# EAGLE design i2c_air_temp_humi_ds18b20_hw2.0 (EAGLE 6.4)
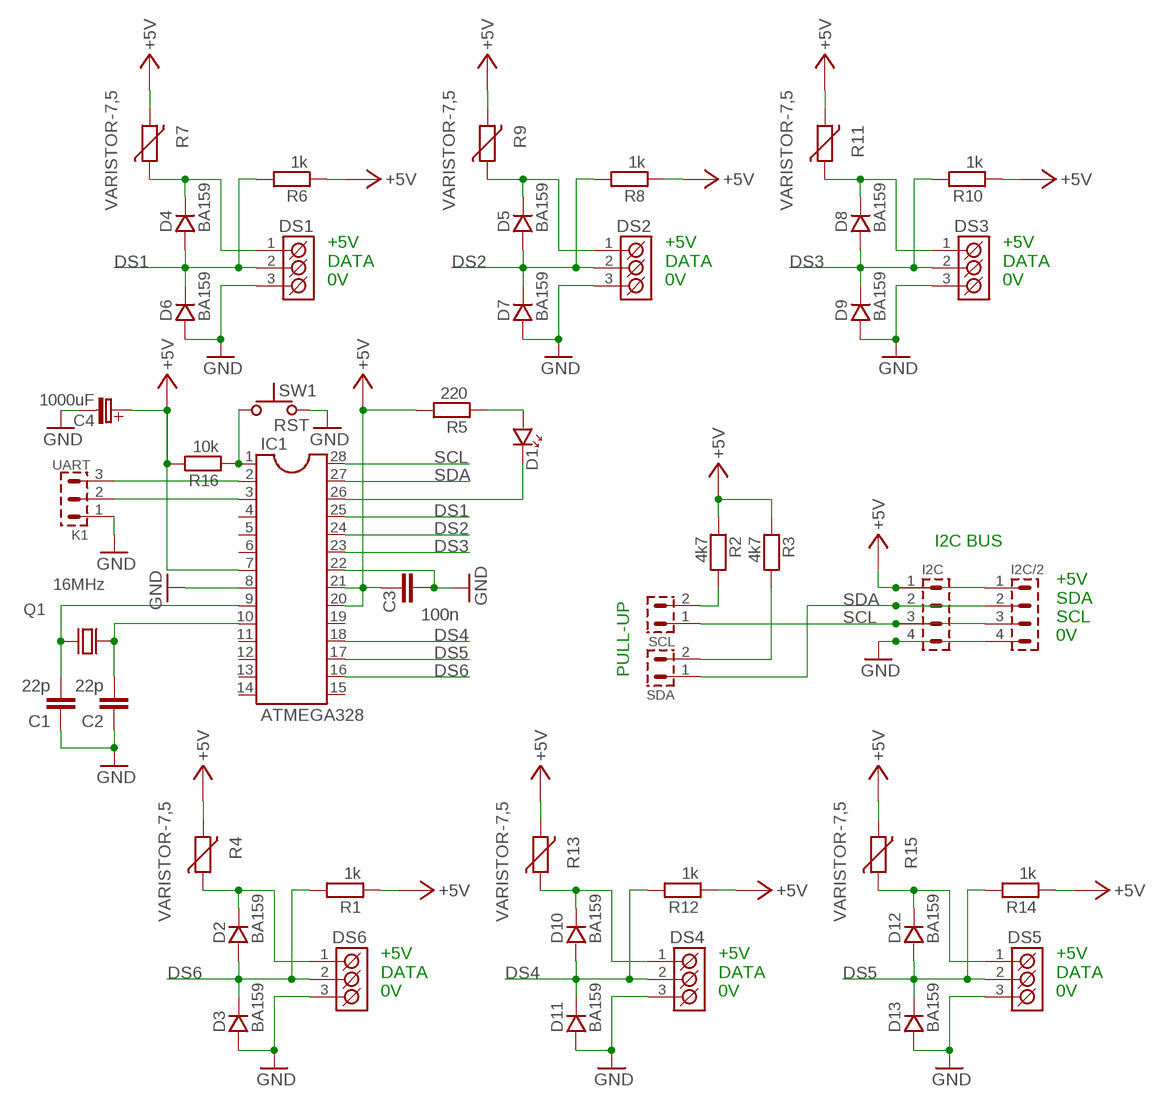
[diagram p0: schematic, sheet 1]

## Parts
C1  22p  C5/3  [C5B3]
C2  22p  C5/3  [C5B3]
C3  100n  C5/3  [C5B3]
C4  1000uF  C-EL_5  [C-EL_5]
D1  LED_3  [LED_3]
D2  BA159  [DO41]
D3  BA159  [DO41]
D4  BA159  [DO41]
D5  BA159  [DO41]
D6  BA159  [DO41]
D7  BA159  [DO41]
D8  BA159  [DO41]
D9  BA159  [DO41]
D10  BA159  [DO41]
D11  BA159  [DO41]
D12  BA159  [DO41]
D13  BA159  [DO41]
DS1  ARK500/3  [ARK500/3]
DS2  ARK500/3  [ARK500/3]
DS3  ARK500/3  [ARK500/3]
DS4  ARK500/3  [ARK500/3]
DS5  ARK500/3  [ARK500/3]
DS6  ARK500/3  [ARK500/3]
I2C  PSH02-04P  [PSH02-04P]
I2C/2  PSH02-04P  [PSH02-04P]
IC1  ATMEGA328  DIL28-3  [DIL28-3]
K1  UART  PSH02-03P  [PSH02-03P]
Q1  16MHz  Q_HC-49U  [HC-49U]
R1  1k  R_7,5  [R-7,5]
R2  4k7  R_7,5  [R-7,5]
R3  4k7  R_7,5  [R-7,5]
R4  VARISTOR-7,5  [R-7,5]
R5  220  R_7,5  [R-7,5]
R6  1k  R_7,5  [R-7,5]
R7  VARISTOR-7,5  [R-7,5]
R8  1k  R_7,5  [R-7,5]
R9  VARISTOR-7,5  [R-7,5]
R10  1k  R_7,5  [R-7,5]
R11  VARISTOR-7,5  [R-7,5]
R12  1k  R_7,5  [R-7,5]
R13  VARISTOR-7,5  [R-7,5]
R14  1k  R_7,5  [R-7,5]
R15  VARISTOR-7,5  [R-7,5]
R16  10k  R_7,5  [R-7,5]
SCL  S1G2_JUMP  [S1G2_JUM]
SDA  S1G2_JUMP  [S1G2_JUM]
SW1  RST  P-B1720  [P-B1720]

## Nets
+5V: C3.1 C4.C+(C_EL+) I2C.1 I2C/2.1 IC1.7 IC1.20 IC1.21 R1.1 R2.1 R3.1 R4.2 R5.2 R6.1 R7.2 R8.1 R9.2 R10.1 R11.2 R12.1 R13.2 R14.1 R15.2 R16.2
DS1: D4.A D6.K DS1.2(K2) IC1.25 R6.2
DS2: D5.A D7.K DS2.2(K2) IC1.24 R8.2
DS3: D8.A D9.K DS3.2(K2) IC1.23 R10.2
DS4: D10.A D11.K DS4.2(K2) IC1.18 R12.2
DS5: D12.A D13.K DS5.2(K2) IC1.17 R14.2
DS6: D2.A D3.K DS6.2(K2) IC1.16 R1.2
GND: C1.1 C2.1 C3.2 C4.C-(C_EL-) D3.A D6.A D7.A D9.A D11.A D13.A DS1.3(K3) DS2.3(K3) DS3.3(K3) DS4.3(K3) DS5.3(K3) DS6.3(K3) I2C.4 I2C/2.4 IC1.8 IC1.22 K1.1 SW1.2
N$1: D2.K DS6.1(K1) R4.1
N$2: C2.2 IC1.10 Q1.1
N$3: D1.K IC1.26
N$4: D1.A R5.1
N$5: R2.2 SCL.2
N$6: R3.2 SDA.2
N$7: D4.K DS1.1(K1) R7.1
N$8: D5.K DS2.1(K1) R9.1
N$9: D10.K DS4.1(K1) R13.1
N$10: D12.K DS5.1(K1) R15.1
N$12: D8.K DS3.1(K1) R11.1
N$13: IC1.1 R16.1 SW1.1
N$14: IC1.2 K1.3
N$15: IC1.3 K1.2
N$21: C1.2 IC1.9 Q1.2
SCL: I2C.3 I2C/2.3 IC1.28 SCL.1
SDA: I2C.2 I2C/2.2 IC1.27 SDA.1
Unconnected: IC1.4 IC1.5 IC1.6 IC1.11 IC1.12 IC1.13 IC1.14 IC1.15 IC1.19 SW1.3(1A) SW1.4(2A)

## Notes on the sheet
- +5V
  DATA
  0V
- +5V
  DATA
  0V
- +5V
  DATA
  0V
- I2C BUS
- +5V
  SDA
  SCL
  0V
- PULL-UP
- +5V
  DATA
  0V
- +5V
  DATA
  0V
- +5V
  DATA
  0V

## Library data of the parts
C1-C3 = capacitor-wima:C: CAPACITOR naming: grid - package width
C4 = #PaJa_31:C-EL: Kondenzator - elektrolyticky
D1 = #PaJa_31:LED: LED - jednobarevna
D2-D13 = #PaJa_31:BA159: Rychlá dioda - 1A, 1000V
DS1-DS6 = #PaJa_konektory:ARK500/3: Svorkovnice - roztec 5mm - trojita
I2C I2C/2 = #PaJa_konektory:PSH02-04: Konektory se zamkem - vidlice - 4pin
IC1 = ic-package:DIL28: Dual In Line
K1 = #PaJa_konektory:PSH02-03: Konektory se zamkem - vidlice - 3pin
Q1 = #PaJa_31:Q: Krystal HC-49 - 1MHz - 48MHz DT38 - Quartz (hodinovy) 32,768kHz
R1-R3 R5 R6 R8 R10 R12 R14 R16 = #PaJa_31:R: Rezistor
R4 R7 R9 R11 R13 R15 = varistor:VARISTOR: VARISTOR
SCL SDA = #PaJa_konektory:S1G2_JUMP: Radove konektory - koliky - 2x
SW1 = #PaJa_prepinace:P-B1720: µ-tlacitko

## Board
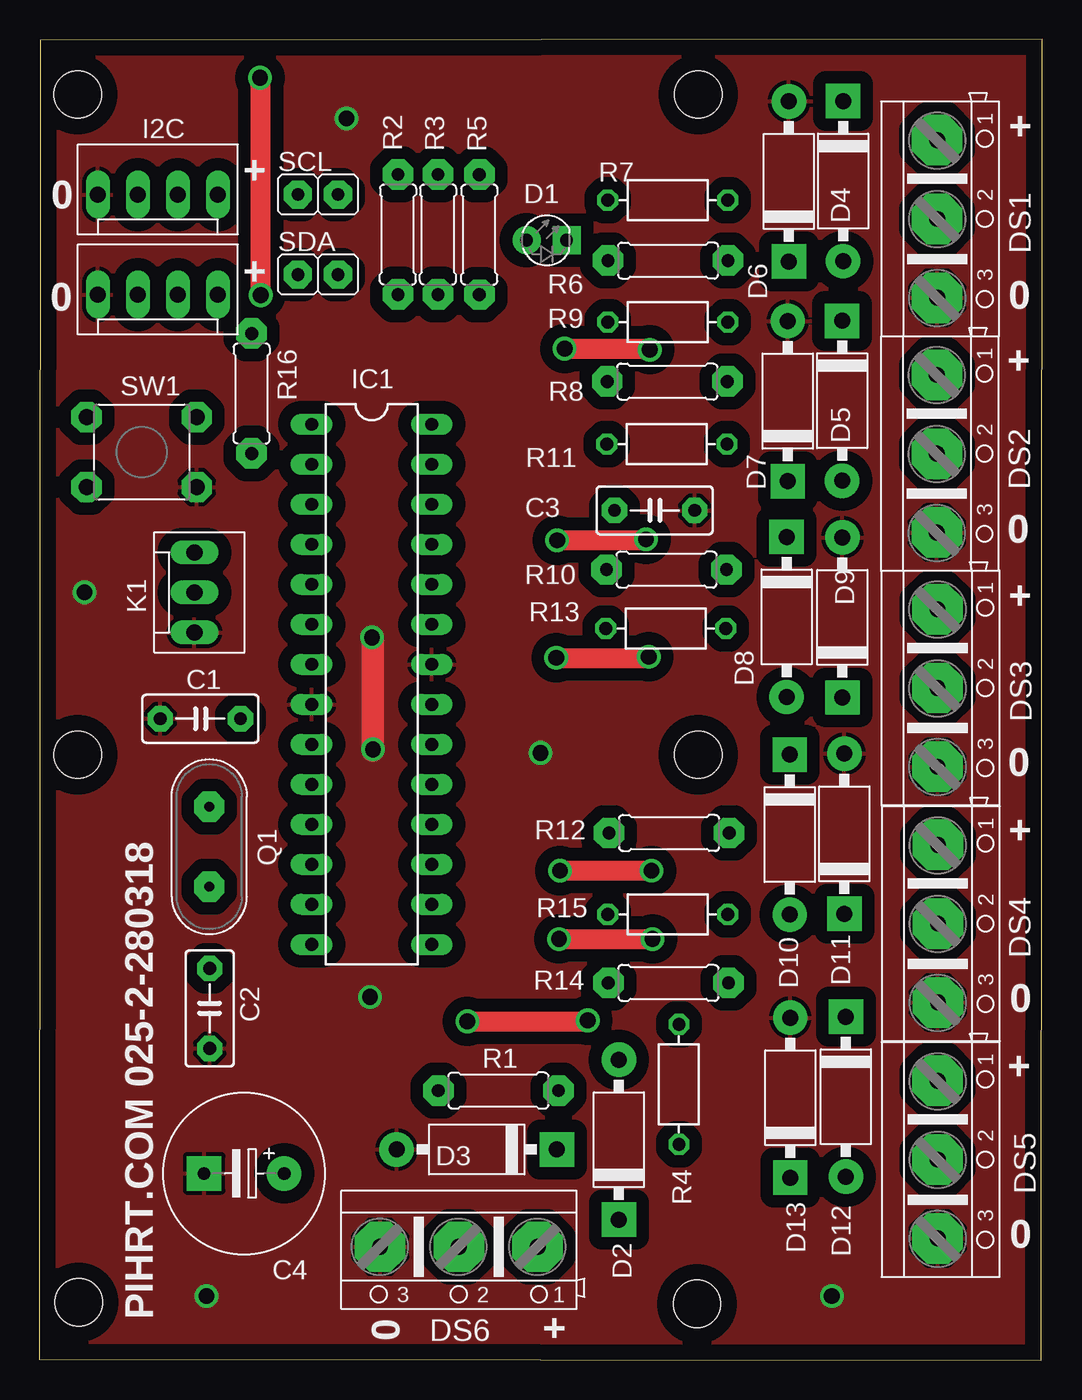
[diagram p1: board, top side]
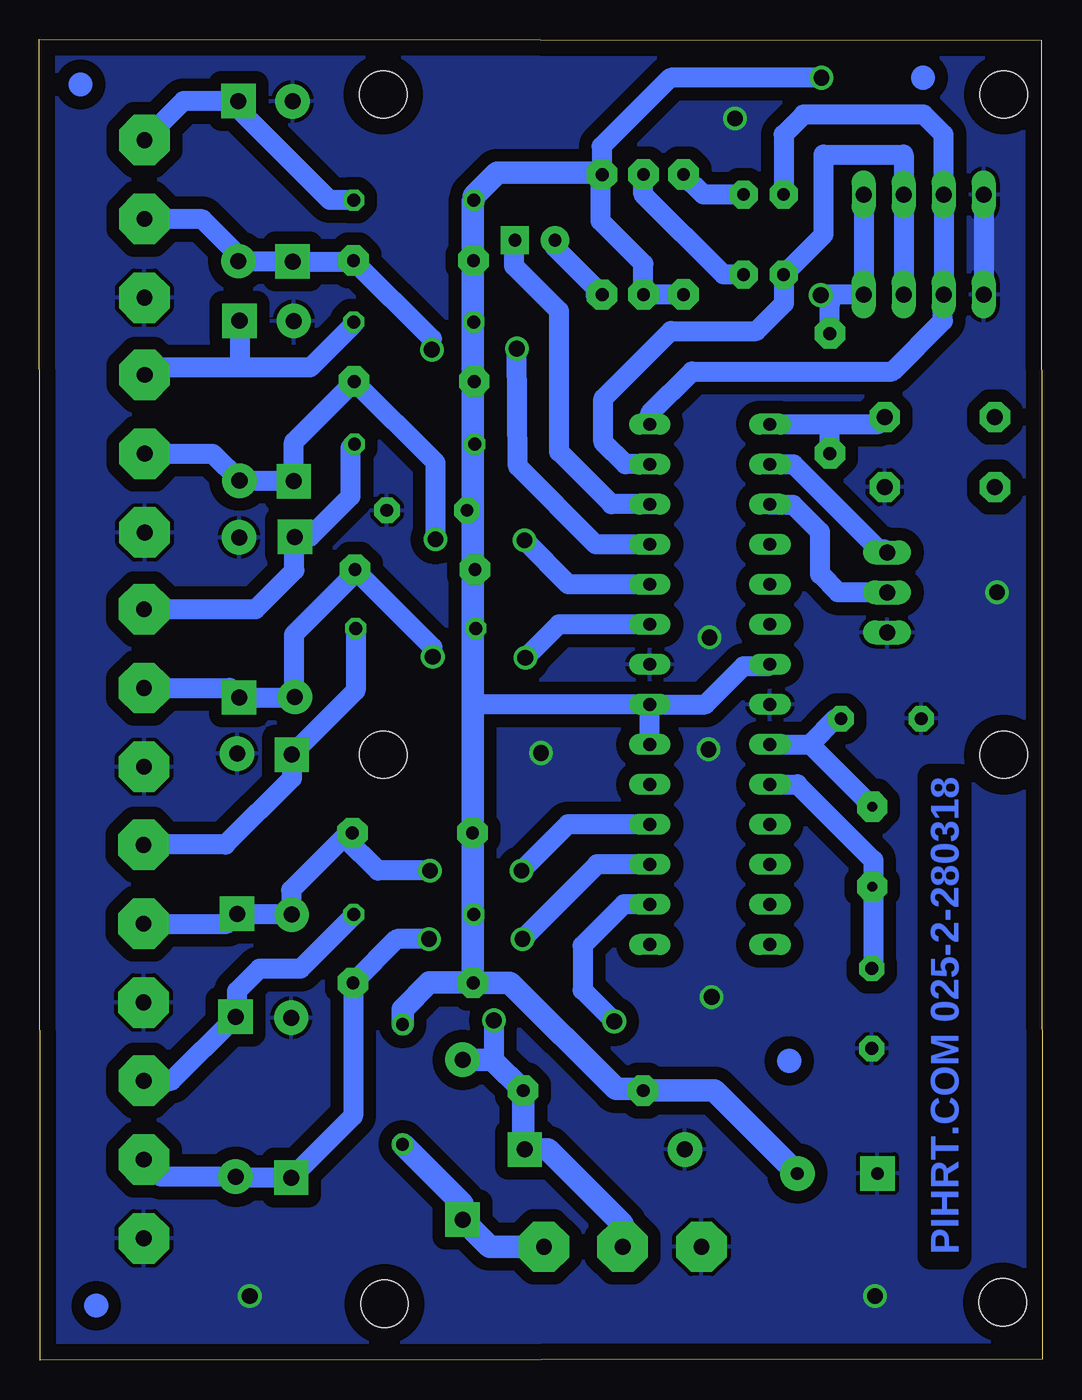
[diagram p2: board, bottom side, seen from below]

Size 63.63 x 83.84 mm. Coordinates in mm from the lower left corner, seen from the top.
Outline: 0,0.05 63.58,0 63.63,83.84 0.05,83.79 0,0.05
Copper layers (1*16): Top 0.035mm / dielectric 1.5mm / Bottom 0.035mm
Design rules "default": minimum track width 10mil, minimum drill 24mil, track to track 8mil, track to pad 8mil, pad to pad 8mil, via to via 8mil, smd to smd 8mil, copper to edge 40mil, drill to drill 8mil, minimum pad ring 10mil, minimum via ring 8mil, stop-mask expansion 4mil, vias tented up to drill 0mil, thermal gap 10mil
Holes 3 mm at 2.44,38.43 41.81,38.43 41.81,80.34 2.44,80.34 41.73,3.57 2.49,3.67

### Footprints (pad centres in the part's own frame; a part is rotated, then mirrored left to right if it is on the bottom)
C5B3 = drill 0.813 pad 1.6 octagon: 1 -2.54,0; 2 2.54,0
C-EL_5 = drill 0.813 pad 2.184: C+ -2.54,0 | drill 0.813 pad 2.184 square: C- 2.54,0
LED_3 = drill 0.813 pad 1.778: A -1.27,0 | drill 0.813 pad 1.778 square: K 1.27,0
DO41 = drill 1.016 pad 2.184: A -5.08,0 | drill 1.016 pad 2.184 square: K 5.08,0
ARK500/3 = drill 1 pad 3.2 octagon: 1 -5,0; 2 0,0; 3 5,0
PSH02-04P = drill 1.016 pad 1.422 long: 1 -3.81,0; 2 -1.27,0; 3 1.27,0; 4 3.81,0
DIL28-3 = drill 0.813 long: 1 -16.51,-3.81; 2 -13.97,-3.81; 3 -11.43,-3.81; 4 -8.89,-3.81; 5 -6.35,-3.81; 6 -3.81,-3.81; 7 -1.27,-3.81; 8 1.27,-3.81; 9 3.81,-3.81; 10 6.35,-3.81; 11 8.89,-3.81; 12 11.43,-3.81; 13 13.97,-3.81; 14 16.51,-3.81; 15 16.51,3.81; 16 13.97,3.81; 17 11.43,3.81; 18 8.89,3.81; 19 6.35,3.81; 20 3.81,3.81; 21 1.27,3.81; 22 -1.27,3.81; 23 -3.81,3.81; 24 -6.35,3.81; 25 -8.89,3.81; 26 -11.43,3.81; 27 -13.97,3.81; 28 -16.51,3.81
PSH02-03P = drill 1.016 pad 1.422 long: 1 -2.54,0; 2 0,0; 3 2.54,0
HC-49U = drill 0.61 pad 1.93 octagon: 1 -2.54,0; 2 2.54,0
R-7,5 = drill 0.813 pad 1.93 octagon: 1 -3.81,0; 2 3.81,0
R-7,5' = drill 0.813 octagon: 1 -3.81,0; 2 3.81,0
S1G2_JUM = drill 0.813 pad 1.778 octagon: 1 -1.27,0; 2 1.27,0
P-B1720 = drill 1 pad 1.93 octagon: 1 -3.493,-2.223; 2 -3.493,2.223; 3 3.493,-2.223; 4 3.493,2.223

### Placement (x,y rotation side)
C1  10.22,40.72 0 top
C2  10.8,22.32 90 top
C3  39.04,53.94 0 top
C4  12.99,11.84 180 top
D1  32.18,71.09 0 top
D2  36.77,13.99 270 top
D3  27.75,13.37 0 top
D4  51,74.84 90 top
D5  50.93,60.9 90 top
D6  47.56,74.82 270 top
D7  47.49,60.88 270 top
D8  47.42,47.18 90 top
D9  50.96,47.14 270 top
D10  47.62,33.36 90 top
D11  51.09,33.41 270 top
D12  51.18,16.72 90 top
D13  47.65,16.66 270 top
DS1  56.97,72.44 270 top
DS2  56.95,57.54 270 top
DS3  56.99,42.67 270 top
DS4  57.02,27.71 270 top
DS5  57,12.73 270 top
DS6  26.62,7.2 180 top
I2C  7.52,67.64 180 top
I2C/2  7.52,73.99 180 top
IC1  21.09,42.9 270 top
K1  9.84,48.74 90 top
Q1  10.78,32.6 90 top
R1  29.13,17.11 0 top
R2  22.76,71.45 90 top
R3  25.3,71.45 90 top
R4  VARISTOR-7,5  [R-7,5']  40.58,17.51 90 top
R5  27.92,71.44 90 top
R6  39.89,69.8 0 top
R7  VARISTOR-7,5  [R-7,5']  39.87,73.63 180 top
R8  39.84,62.12 0 top
R9  VARISTOR-7,5  [R-7,5']  39.88,65.9 180 top
R10  39.8,50.19 0 top
R11  VARISTOR-7,5  [R-7,5']  39.82,58.15 180 top
R12  39.96,33.47 0 top
R13  VARISTOR-7,5  [R-7,5']  39.75,46.45 180 top
R14  39.91,23.95 0 top
R15  VARISTOR-7,5  [R-7,5']  39.88,28.29 180 top
R16  13.47,61.36 90 top
SCL  17.68,73.99 0 top
SDA  17.68,68.91 0 top
SW1  6.49,57.64 180 top

### Tracks (layer width: path | path; a pad name or v marks a point on that pad's centre or on a via)
+5V  (via drill 1)
  Top 1.27: v14.05,67.61 14.05,81.36 v14,81.41
  Bottom 0.813: R6.1 36.08,68.83 36.14,68.78 36.14,65.97 R9.2 36.07,62.15 R8.1 36.01,62.1 R11.2 | C3.1 36.5,54.1 36.14,54.46 | R10.1 35.99,52.23 36.14,52.38 | 35.99,46.49 35.99,49.48 36.14,49.63 | R15.2 36.07,32.29 36.14,32.36 | R12.1 36.15,32.51 36.14,32.5
  Bottom 1.27: I2C/2.1 I2C.1 14.01,67.64 v14.05,67.61 | 36.08,73.61 R7.2 | 35.99,46.49 R13.2 | IC1.20 IC1.21 | IC1.21 21.37,41.63 18.95,44.05 17.4,44.05 IC1.7 | 25.16,67.43 24.95,67.64 R2.1 R3.1 25.3,69.6 28.01,72.31 28.01,75.16 R5.2 27.95,75.28 27.95,77.05 23.59,81.41 v14,81.41 | 14,67.56 v14.05,67.61 | IC1.21 35.95,41.63 36.14,41.81 | R16.2 13.47,67.03 v14.05,67.61
  Bottom 1.422: R4.2 40.58,22.28 38.88,23.98 36.14,23.98 | 36.14,23.98 R14.1 33.77,23.95 27.04,17.21 25.42,17.21 R1.1 20.8,17.11 C4.C+ | 36.14,23.98 36.14,32.36 36.14,32.5 36.14,41.81 36.14,49.63 36.14,52.38 36.14,54.46 36.14,68.78 36.14,73.56 R7.2 36.06,73.89 34.58,75.37 28.03,75.37 R5.2
DS1  (via drill 1)
  Top 1.27: v33.33,64.21 38.74,64.21 v38.73,64.14
  Bottom 1.27: DS1.2 56.95,72.42 53.29,72.42 51,70.14 D4.A 47.58,69.76 D6.K 43.76,69.74 R6.2 38.73,64.83 v38.73,64.14 | IC1.25 28.31,51.79 33.27,56.74 v33.33,64.21
DS2  (via drill 1)
  Top 1.27: v32.85,52.04 38.44,52.04 v38.49,52.1
  Bottom 1.27: DS2.2 52.65,57.54 D5.A 47.51,55.82 D7.K 47.49,58.29 R8.2 38.49,56.96 v38.49,52.1 | IC1.24 30.06,49.25 v32.85,52.04
DS3  (via drill 1)
  Top 1.27: v32.8,44.58 38.61,44.58 v38.67,44.64
  Bottom 1.27: DS3.2 51.56,42.67 D9.K 47.45,42.06 D8.A 47.48,42.16 47.48,46.05 43.61,49.93 R10.2 38.67,45.25 v38.67,44.64 | IC1.23 30.67,46.71 v32.8,44.58
DS4  (via drill 1)
  Top 1.27: v33.03,31.08 v38.85,31.08
  Bottom 1.27: DS4.2 51.72,27.71 D11.K 47.67,28.33 D10.A 47.66,28.32 47.66,29.84 44.28,33.22 | R12.2 44.04,33.47 44.28,33.22 | IC1.18 30.1,34.01 v33.03,31.08 | v38.85,31.08 42.14,31.08 44.28,33.22
DS5  (via drill 1)
  Top 1.27: v32.97,26.73 v38.91,26.73 38.96,26.73
  Bottom 1.27: DS5.2 55.91,11.64 D12.A 51.11,11.58 D13.K 43.72,15.5 R14.2 40.94,26.73 v38.91,26.73 | IC1.17 28.23,31.47 v32.97,26.73
DS6  (via drill 1)
  Top 1.27: v27.16,21.5 34.73,21.5 v34.79,21.56
  Bottom 1.27: IC1.16 26.55,28.93 29.15,26.32 29.15,23.5 v27.16,21.5 | v34.79,21.56 34.79,19.25 34.97,19.07
  Bottom 1.422: D2.A 34.97,19.07 34.89,19.07 R1.2 32.94,13.48 D3.K 31.37,13.37 26.63,8.63 26.63,7.21 DS6.2
GND  (via drill 1)
  Top 1.422: 21.16,38.71 21.16,45.76 21.11,45.82
  Bottom 1.27: I2C/2.4 I2C.4 3.69,67.64
  other vias: 21.16,38.77 21.11,45.88 19.49,78.83 2.86,48.73 20.97,23.05 10.6,4.07 50.29,4.07 31.8,38.54
  pour Bottom (isolate 0.813): -1.52,85.14 66.33,85.14 66.33,-3.39 -1.52,-3.39 -1.48,84.39
  pour Top (isolate 0.813): -0.67,83.86 65.05,83.86 65.05,-1.68 -0.53,-1.68 -0.61,83.45
N$1
  Bottom 1.422: DS6.1 35.06,7.2 D2.K 36.77,9.89 R4.1
N$2
  Bottom 1.27: IC1.10 15.53,36.55 10.71,31.72 10.71,30.61 | 10.71,30.61 10.71,24.96 C2.2 | Q1.1 10.78,30.54 10.71,30.61
N$3
  Bottom 1.27: IC1.26 27.32,54.33 30.66,57.66 30.66,66.59 33.51,69.45 33.51,71.03 D1.K
N$4
  Bottom 1.27: 28.34,67.63 R5.1 30.91,70.63 D1.A
N$5
  Bottom 1.27: SCL.2 21.49,73.99 R2.2
N$6
  Bottom 1.27: SDA.2 20.22,68.91 25.3,73.99 R3.2
N$7
  Bottom 1.27: D4.K 51.49,79.92 | 51.49,79.92 54.49,79.92 DS1.1 | R7.1 45.21,73.63 51.49,79.92
N$8
  Bottom 1.27: R9.1 43.69,65.77 46.46,63 51.15,63 | 51.15,63 56.48,63 DS2.1 | D5.K 50.93,63.22 51.15,63
N$9
  Bottom 1.27: R13.1 43.56,42.49 D10.K 47.62,36.93 51.83,32.72 57,32.72 DS4.1
N$10
  Bottom 1.27: DS5.1 55.25,17.73 D12.K 51.1,21.87 51.1,23.42 49.68,24.84 47.06,24.84 43.69,28.22 R15.1
N$12
  Bottom 1.27: DS3.1 49.91,47.67 47.45,50.13 47.45,52.22 D8.K 46.47,52.26 43.88,54.85 43.88,57.9 R11.1
N$13
  Bottom 1.27: IC1.1 13.06,59.41 | 13.06,59.41 10.44,59.41 SW1.1 | R16.1 13.47,58.99 13.06,59.41
N$14
  Bottom 1.27: IC1.2 15.79,56.87 10.4,51.48 10.04,51.48 K1.3
N$15
  Bottom 1.27: K1.2 12.95,48.74 14.1,49.89 14.1,52.58 15.81,54.29 17.24,54.29 IC1.3
N$17
  cutout Bottom: 0.04,82.77 -0.03,82.77 -0.03,76.35
N$21
  Bottom 1.27: IC1.9 14.73,39.09 | 14.73,39.09 Q1.2 | C1.2 13.1,40.72 14.73,39.09
SCL
  Bottom 1.27: SCL.1 16.41,77.8 15.14,79.07 7.52,79.07 6.25,77.8 I2C/2.3 I2C.3 6.3,67.59 6.3,65.98 9.52,62.76 22.21,62.76 24.9,60.08 IC1.28
SDA
  Bottom 1.27: I2C.2 I2C/2.2 8.79,76.53 13.87,76.53 13.87,71.45 SDA.1 16.38,68.88 16.38,67.08 18.13,65.33 23.56,65.33 27.84,61.05 27.84,58.28 26.44,56.87 IC1.27
(copper drawn outside any net)
  shapes: Bottom circle x4

### Text on the board
Bottom: PIHRT.COM 025-2-280318
tNames: I2C | + | + | 0 | + | 0 | 0 | + | 0 | + | 0 | + | 0 | + | 0 | PIHRT.COM 025-2-280318 | 0 | +